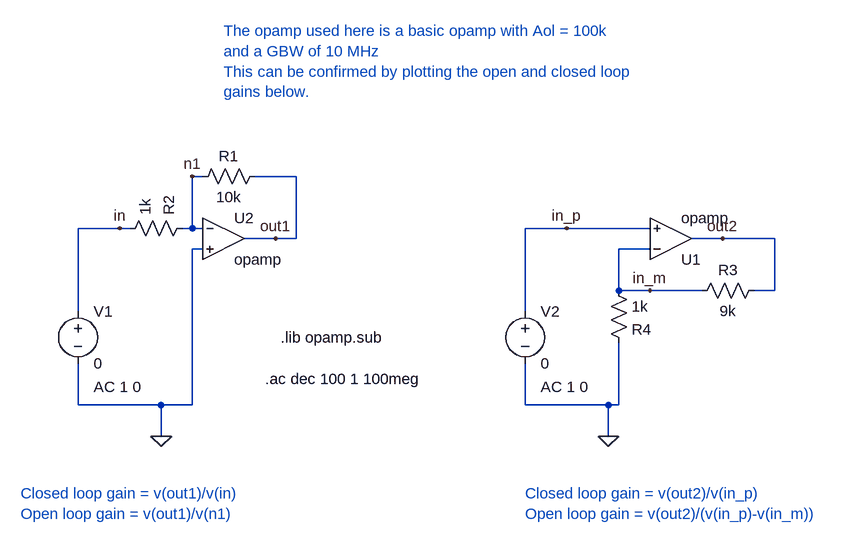
[diagram p0: schematic opamp_test.asc]
opamp_test.asc, the LTspice schematic file:
Version 4
SHEET 1 1072 680
WIRE -128 256 -128 128
WIRE -128 400 -128 336
WIRE -64 128 -128 128
WIRE -48 128 -64 128
WIRE 0 400 -128 400
WIRE 0 448 0 400
WIRE 48 128 32 128
WIRE 48 128 48 48
WIRE 48 400 0 400
WIRE 48 400 48 160
WIRE 64 48 48 48
WIRE 64 128 48 128
WIRE 64 160 48 160
WIRE 176 144 128 144
WIRE 208 48 144 48
WIRE 208 144 176 144
WIRE 208 144 208 48
WIRE 560 256 560 128
WIRE 560 400 560 336
WIRE 624 128 560 128
WIRE 688 400 560 400
WIRE 688 448 688 400
WIRE 704 224 704 160
WIRE 704 400 688 400
WIRE 704 400 704 304
WIRE 752 128 624 128
WIRE 752 160 704 160
WIRE 752 224 704 224
WIRE 832 224 752 224
WIRE 864 144 816 144
WIRE 944 144 864 144
WIRE 944 224 912 224
WIRE 944 224 944 144
FLAG 0 448 0
FLAG 176 144 out1
FLAG -64 128 in
FLAG 48 48 n1
FLAG 688 448 0
FLAG 864 144 out2
FLAG 624 128 in_p
FLAG 752 224 in_m
SYMBOL Opamps\\opamp 96 80 R0
SYMATTR InstName U2
SYMBOL res 160 32 R90
WINDOW 0 0 56 VBottom 0
WINDOW 3 32 56 VTop 0
SYMATTR InstName R1
SYMATTR Value 10k
SYMBOL res -64 144 R270
WINDOW 0 36 76 Left 0
WINDOW 3 36 40 Left 0
SYMATTR InstName R2
SYMATTR Value 1k
SYMBOL voltage -128 240 R0
WINDOW 123 24 132 Left 0
WINDOW 39 0 0 Left 0
SYMATTR InstName V1
SYMATTR Value 0
SYMATTR Value2 AC 1 0
SYMBOL Opamps\\opamp 784 208 M180
SYMATTR InstName U1
SYMBOL res 928 208 R90
WINDOW 0 0 56 VBottom 0
WINDOW 3 32 56 VTop 0
SYMATTR InstName R3
SYMATTR Value 9k
SYMBOL res 688 208 R0
WINDOW 0 36 76 Left 0
WINDOW 3 36 40 Left 0
SYMATTR InstName R4
SYMATTR Value 1k
SYMBOL voltage 560 240 R0
WINDOW 123 24 132 Left 0
WINDOW 39 0 0 Left 0
SYMATTR InstName V2
SYMATTR Value 0
SYMATTR Value2 AC 1 0
TEXT 184 296 Left 0 !.lib opamp.sub
TEXT 160 360 Left 0 !.ac dec 100 1 100meg
TEXT 560 536 Left 0 ;Closed loop gain = v(out2)/v(in_p)\nOpen loop gain = v(out2)/(v(in_p)-v(in_m))
TEXT 96 -176 Left 0 ;The opamp used here is a basic opamp with Aol = 100k\nand a GBW of 10 MHz\nThis can be confirmed by plotting the open and closed loop\ngains below.
TEXT -216 536 Left 0 ;Closed loop gain = v(out1)/v(in)\nOpen loop gain = v(out1)/v(n1)

The netlist it stands for:
* opamp_test.asc
XU2 n1 0 out1 opamp Aol=100K GBW=10Meg  ; pins invin noninvin out
R1 out1 n1 10k
R2 in n1 1k
V1 in 0 0 AC 1 0
XU1 in_m in_p out2 opamp Aol=100K GBW=10Meg  ; pins invin noninvin out
R3 out2 in_m 9k
R4 in_m 0 1k
V2 in_p 0 0 AC 1 0
.lib opamp.sub
.ac dec 100 1 100meg
* Closed loop gain = v(out2)/v(in_p)
* Open loop gain = v(out2)/(v(in_p)-v(in_m))
* The opamp used here is a basic opamp with Aol = 100k
* and a GBW of 10 MHz
* This can be confirmed by plotting the open and closed loop
* gains below.
* Closed loop gain = v(out1)/v(in)
* Open loop gain = v(out1)/v(n1)
.backanno
.end